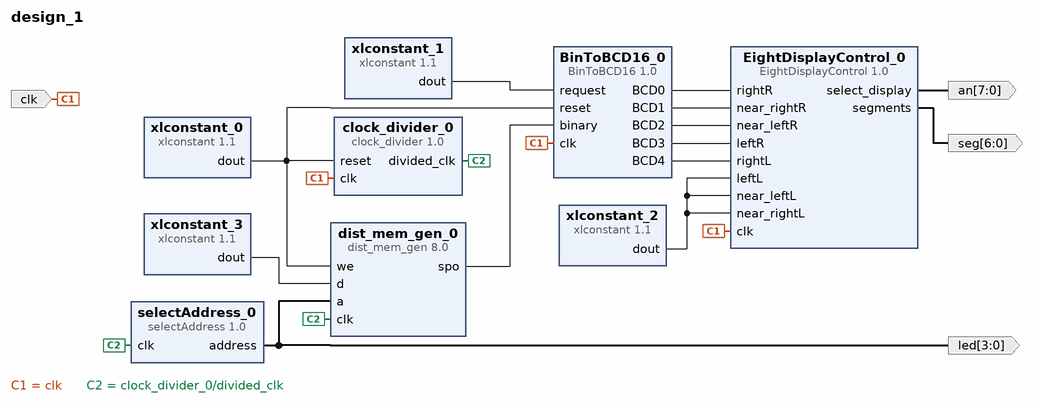
[diagram p0: block diagram of the top level]
# Vivado block design design_1, xc7a100tcsg324-1, Vivado 2016.4
create_bd_design design_1

create_bd_port -dir I -type clk clk
set_property -dict {CONFIG.FREQ_HZ 100000000} [get_bd_ports clk]
create_bd_port -dir O -from 3 -to 0 led
create_bd_port -dir O -from 7 -to 0 an
create_bd_port -dir O -from 6 -to 0 seg

create_bd_cell -type ip -vlnv xilinx.com:user:clock_divider:1.0 clock_divider_0
set_property -dict {CONFIG.how_fast 26} [get_bd_cells clock_divider_0]
create_bd_cell -type ip -vlnv xilinx.com:ip:dist_mem_gen:8.0 dist_mem_gen_0
set_property -dict [list \
  CONFIG.depth 16 \
  CONFIG.data_width 16 \
  CONFIG.memory_type single_port_ram \
  CONFIG.input_options non_registered \
  CONFIG.input_clock_enable false \
  CONFIG.coefficient_file ../../../../../../../../Aula3/Aula3_estudo_ex4/coe/aula6_ex1.coe \
] [get_bd_cells dist_mem_gen_0]
create_bd_cell -type ip -vlnv xilinx.com:user:BinToBCD16:1.0 BinToBCD16_0
create_bd_cell -type ip -vlnv xilinx.com:user:EightDisplayControl:1.0 EightDisplayControl_0
create_bd_cell -type ip -vlnv xilinx.com:user:selectAddress:1.0 selectAddress_0
create_bd_cell -type ip -vlnv xilinx.com:ip:xlconstant:1.1 xlconstant_0
set_property -dict {CONFIG.CONST_VAL 0} [get_bd_cells xlconstant_0]
create_bd_cell -type ip -vlnv xilinx.com:ip:xlconstant:1.1 xlconstant_1
create_bd_cell -type ip -vlnv xilinx.com:ip:xlconstant:1.1 xlconstant_2
set_property -dict {CONFIG.CONST_WIDTH 4 CONFIG.CONST_VAL 0} [get_bd_cells xlconstant_2]
create_bd_cell -type ip -vlnv xilinx.com:ip:xlconstant:1.1 xlconstant_3
set_property -dict {CONFIG.CONST_WIDTH 16} [get_bd_cells xlconstant_3]

# ---- connections ----

connect_bd_net [get_bd_ports clk] [get_bd_pins clock_divider_0/clk] [get_bd_pins BinToBCD16_0/clk] [get_bd_pins EightDisplayControl_0/clk]
connect_bd_net [get_bd_pins xlconstant_0/dout] [get_bd_pins clock_divider_0/reset] [get_bd_pins BinToBCD16_0/reset] [get_bd_pins dist_mem_gen_0/we]
connect_bd_net [get_bd_pins selectAddress_0/address] [get_bd_ports led] [get_bd_pins dist_mem_gen_0/a]
connect_bd_net [get_bd_pins xlconstant_1/dout] [get_bd_pins BinToBCD16_0/request]
connect_bd_net [get_bd_pins BinToBCD16_0/BCD0] [get_bd_pins EightDisplayControl_0/rightR]
connect_bd_net [get_bd_pins BinToBCD16_0/BCD1] [get_bd_pins EightDisplayControl_0/near_rightR]
connect_bd_net [get_bd_pins BinToBCD16_0/BCD2] [get_bd_pins EightDisplayControl_0/near_leftR]
connect_bd_net [get_bd_pins BinToBCD16_0/BCD3] [get_bd_pins EightDisplayControl_0/leftR]
connect_bd_net [get_bd_pins BinToBCD16_0/BCD4] [get_bd_pins EightDisplayControl_0/rightL]
connect_bd_net [get_bd_pins xlconstant_2/dout] \
  [get_bd_pins EightDisplayControl_0/near_rightL] [get_bd_pins EightDisplayControl_0/near_leftL] \
  [get_bd_pins EightDisplayControl_0/leftL]
connect_bd_net [get_bd_pins dist_mem_gen_0/spo] [get_bd_pins BinToBCD16_0/binary]
connect_bd_net [get_bd_pins xlconstant_3/dout] [get_bd_pins dist_mem_gen_0/d]
connect_bd_net [get_bd_pins EightDisplayControl_0/select_display] [get_bd_ports an]
connect_bd_net [get_bd_pins EightDisplayControl_0/segments] [get_bd_ports seg]
connect_bd_net [get_bd_pins clock_divider_0/divided_clk] [get_bd_pins selectAddress_0/clk] [get_bd_pins dist_mem_gen_0/clk]

validate_bd_design
save_bd_design
